# EAGLE design Touchstone (EAGLE 8.3.2)
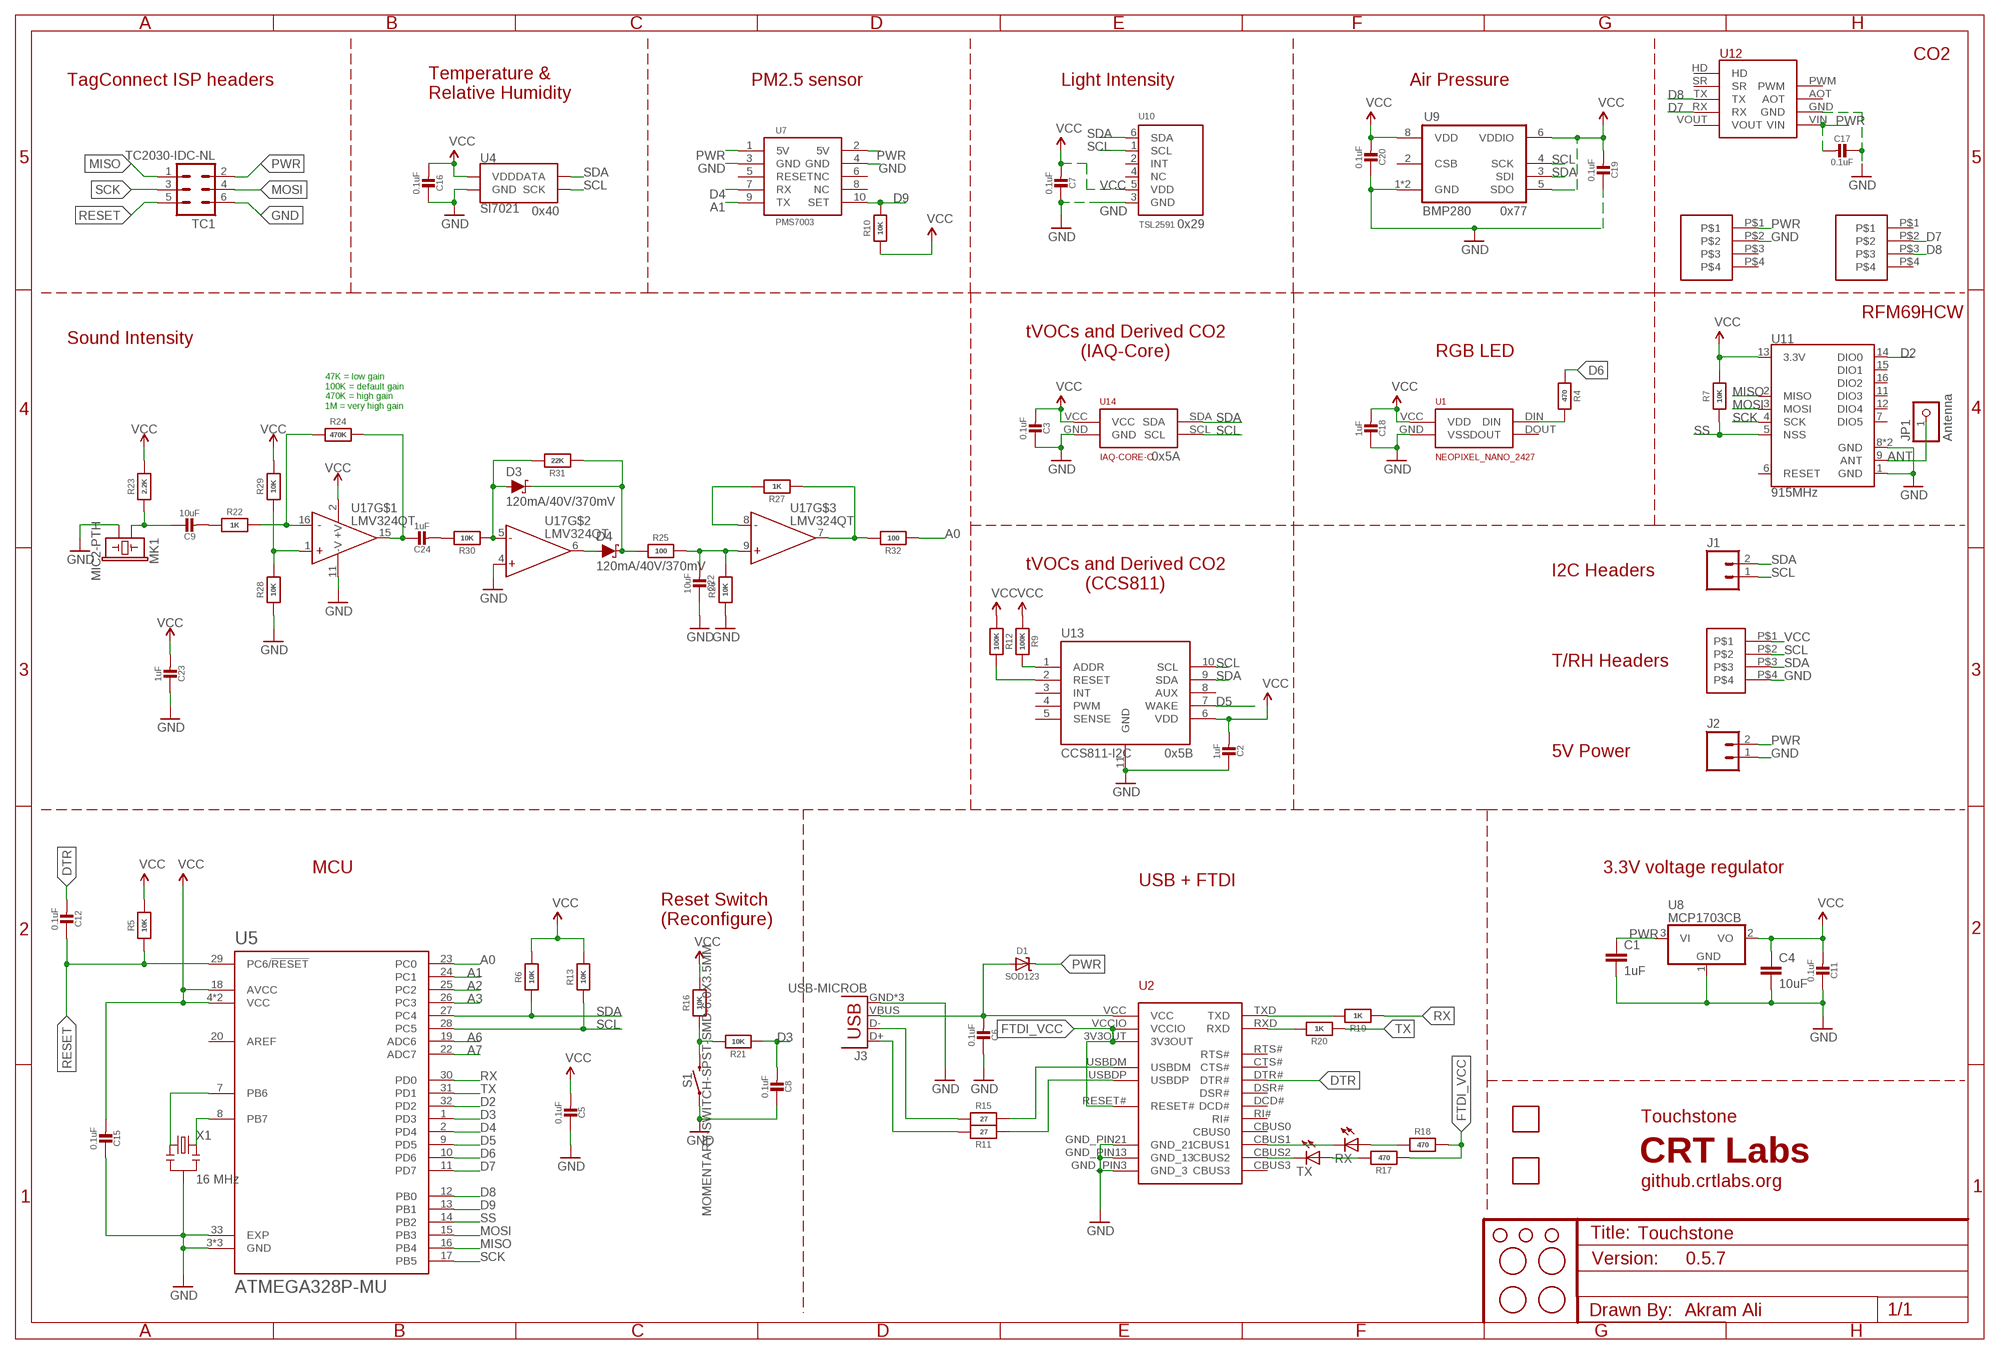
[diagram p0: schematic, sheet 1]

## Parts
C1  1uF  CAP0805  [0805]
C2  1uF  MICROBUILDER_CAP_CERAMIC_0402MP  [MICROBUILDER__0402MP]
C3  0.1uF  MICROBUILDER_CAP_CERAMIC_0402MP  [MICROBUILDER__0402MP]
C4  10uF  CAP0805  [0805]
C5  0.1uF  MICROBUILDER_CAP_CERAMIC_0402MP  [MICROBUILDER__0402MP]
C6  0.1uF  MICROBUILDER_CAP_CERAMIC_0402MP  [MICROBUILDER__0402MP]
C7  0.1uF  MICROBUILDER_CAP_CERAMIC_0402MP  [MICROBUILDER__0402MP]
C8  0.1uF  MICROBUILDER_CAP_CERAMIC_0402MP  [MICROBUILDER__0402MP]
C9  10uF  MICROBUILDER_CAP_CERAMIC_0402MP  [MICROBUILDER__0402MP]
C11  0.1uF  MICROBUILDER_CAP_CERAMIC_0402MP  [MICROBUILDER__0402MP]
C12  0.1uF  MICROBUILDER_CAP_CERAMIC_0402MP  [MICROBUILDER__0402MP]
C15  0.1uF  MICROBUILDER_CAP_CERAMIC_0402MP  [MICROBUILDER__0402MP]
C16  0.1uF  MICROBUILDER_CAP_CERAMIC_0402MP  [MICROBUILDER__0402MP]
C17  0.1uF  MICROBUILDER_CAP_CERAMIC_0402MP  [MICROBUILDER__0402MP]
C18  1uF  MICROBUILDER_CAP_CERAMIC_0402MP  [MICROBUILDER__0402MP]
C19  0.1uF  MICROBUILDER_CAP_CERAMIC_0402MP  [MICROBUILDER__0402MP]
C20  0.1uF  MICROBUILDER_CAP_CERAMIC_0402MP  [MICROBUILDER__0402MP]
C22  10uF  MICROBUILDER_CAP_CERAMIC_0402MP  [MICROBUILDER__0402MP]
C23  1uF  MICROBUILDER_CAP_CERAMIC_0402MP  [MICROBUILDER__0402MP]
C24  1uF  MICROBUILDER_CAP_CERAMIC_0402MP  [MICROBUILDER__0402MP]
D1  SOD123  MICROBUILDER_DIODE-SCHOTTKYSOD-123  [MICROBUILDER_SOD-123]
D3  120mA/40V/370mV  DIODE-SCHOTTKY-RB751S40  [SOD-523]
D4  120mA/40V/370mV  DIODE-SCHOTTKY-RB751S40  [SOD-523]
H1  STAND-OFF  [STAND-OFF]
H2  STAND-OFF  [STAND-OFF]
H3  STAND-OFF  [STAND-OFF]
J1  M02PTH  [1X02]
J2  M02PTH  [1X02]
J3  USB-MICROB  [USB-MICROB]
JP1  Antenna  PINHD-1X1CB  [1X01-CLEANBIG]
MK1  MIC2-PTH  [MICROPHONE-PTH-4.0MM]
R4  470  MICROBUILDER_RESISTOR_0402MP  [MICROBUILDER__0402MP]
R5  10K  MICROBUILDER_RESISTOR_0402MP  [MICROBUILDER__0402MP]
R6  10K  MICROBUILDER_RESISTOR_0402MP  [MICROBUILDER__0402MP]
R7  10K  MICROBUILDER_RESISTOR_0402MP  [MICROBUILDER__0402MP]
R9  100K  MICROBUILDER_RESISTOR_0402MP  [MICROBUILDER__0402MP]
R10  10K  MICROBUILDER_RESISTOR_0402MP  [MICROBUILDER__0402MP]
R11  27  MICROBUILDER_RESISTOR_0402MP  [MICROBUILDER__0402MP]
R12  100K  MICROBUILDER_RESISTOR_0402MP  [MICROBUILDER__0402MP]
R13  10K  MICROBUILDER_RESISTOR_0402MP  [MICROBUILDER__0402MP]
R15  27  MICROBUILDER_RESISTOR_0402MP  [MICROBUILDER__0402MP]
R16  10K  MICROBUILDER_RESISTOR_0402MP  [MICROBUILDER__0402MP]
R17  470  MICROBUILDER_RESISTOR_0402MP  [MICROBUILDER__0402MP]
R18  470  MICROBUILDER_RESISTOR_0402MP  [MICROBUILDER__0402MP]
R19  1K  MICROBUILDER_RESISTOR_0402MP  [MICROBUILDER__0402MP]
R20  1K  MICROBUILDER_RESISTOR_0402MP  [MICROBUILDER__0402MP]
R21  10K  MICROBUILDER_RESISTOR_0402MP  [MICROBUILDER__0402MP]
R22  1K  MICROBUILDER_RESISTOR_0402MP  [MICROBUILDER__0402MP]
R23  2.2K  MICROBUILDER_RESISTOR_0402MP  [MICROBUILDER__0402MP]
R24  470K  MICROBUILDER_RESISTOR_0402MP  [MICROBUILDER__0402MP]
R25  100  MICROBUILDER_RESISTOR_0402MP  [MICROBUILDER__0402MP]
R26  10K  MICROBUILDER_RESISTOR_0402MP  [MICROBUILDER__0402MP]
R27  1K  MICROBUILDER_RESISTOR_0402MP  [MICROBUILDER__0402MP]
R28  10K  MICROBUILDER_RESISTOR_0402MP  [MICROBUILDER__0402MP]
R29  10K  MICROBUILDER_RESISTOR_0402MP  [MICROBUILDER__0402MP]
R30  10K  MICROBUILDER_RESISTOR_0402MP  [MICROBUILDER__0402MP]
R31  22K  MICROBUILDER_RESISTOR_0402MP  [MICROBUILDER__0402MP]
R32  100  MICROBUILDER_RESISTOR_0402MP  [MICROBUILDER__0402MP]
RX  LEDCHIPLED_0805  [CHIPLED_0805]
S1  MOMENTARY-SWITCH-SPST-SMD-6.0X3.5MM  [TACTILE_SWITCH_SMD_6.0X3.5MM]
TC1  TC2030-IDC-NL  [TC2030-IDC-NL]
TX  LEDCHIPLED_0805  [CHIPLED_0805]
U1  NEOPIXEL_NANO_2427  [SK6805-2427]
U2  FT231XQ-R  [FTDI_FT231XQ-R_PACKAGE]
U4  SI7021  [DFN-6-3X3-SI7021]
U5  ATMEGA328P-MU  [QFN50P500X500X100-33N]
U7  PMS7003  [PMS7003_RECEPTACLE_1.27MM_2X5]
U8  MCP1703CB  [SOT23]
U9  BMP280  [BMP280]
U10  TSL2591  LIGHT_TSL2591  [DFN6_TAOS]
U11  915MHz  RFM69HCW-915  [RFM69HCW-XXXS2]
U12  MH-Z19  [MH-Z19]
U13  CCS811-I2C  [LGA]
U14  IAQ-CORE-C  [IAQ-CORE-C]
U15  VLP-450-F  [VLP-450-F]
U16  VLP-450-F  [VLP-450-F]
U17  LMV324QT  [QFN-16_3X3]
U$1  FIDUCIAL  [FIDUCIAL_1MM]
U$2  FIDUCIAL  [FIDUCIAL_1MM]
U$3  FIDUCIAL  [FIDUCIAL_1MM]
U$4  0878980426  [CONN_4POS_VERT_2.54_SMD]
U$5  0878980426  [CONN_4POS_VERT_2.54_SMD]
U$6  CONN_HDR_1.27MM_SMD_4POS  [CONN_HDR_1.27MM_SMD_4POS]
U$7  FIDUCIAL  [FIDUCIAL_1MM]
X1  16 MHz  RESONATORSMD  [RESONATOR-SMD]

## Nets
_OUT: R27.1 R32.2 U17.7(OUT)
A0: R32.1 U5.23(PC0)
A1: U5.24(PC1) U7.9(TX)
A2: U5.25(PC2)
A3: U5.26(PC3)
A6: U5.19(ADC6)
A7: U5.22(ADC7)
AMP: C24.1 R24.2 U17.15(OUT)
ANT: JP1.1 U11.9(ANT)
D2: U5.32(PD2) U11.14(DIO0)
D3: C8.2 R21.1 U5.1(PD3)
D4: U5.2(PD4) U7.7(RX)
D5: U5.9(PD5) U13.7(WAKE)
D6: R4.1 U5.10(PD6)
D7: U5.11(PD7) U12.RX U$5.P$2
D8: U5.12(PB0) U12.TX U$5.P$3
D9: R10.2 U5.13(PB1) U7.10(SET)
DTR: C12.2 U2.DTR#
FTDI_VCC: R17.1 R18.2 U2.3V3OUT U2.RESET# U2.VCCIO
GND: C1.2 C2.1 C3.1 C4.2 C5.1 C6.1 C7.1 C8.1 C11.1 C15.1 C16.1 C17.1 C18.1 C19.1 C20.1 C22.1 C23.1 J2.1 J3.GND J3.MT1(GND) J3.MT2(GND) MK1.GND R26.1 R28.1 S1.1 TC1.6 U1.GND(VSS) U2.GND_PIN3(GND_3) U2.GND_PIN13(GND_13) U2.GND_PIN21(GND_21) U4.GND U5.3(GND) U5.5(GND) U5.21(GND) U5.33(EXP) U7.3(GND) U7.4(GND) U8.1(GND) U9.1(GND) U9.7(GND) U10.3(GND) U11.1(GND) U11.8(GND) U11.10(GND) U12.GND U13.11(GND) U14.GND U17.4(+IN) U17.11(-V) U$4.P$2 U$6.P$4 X1.2
MISO: TC1.1 U5.16(PB4) U11.2(MISO)
MOSI: TC1.4 U5.15(PB3) U11.3(MOSI)
N$1: R4.2 U1.DIN
N$2: R20.2 U2.RXD
N$3: R19.2 U2.TXD
N$4: U5.8(PB7) X1.3
N$5: U5.7(PB6) X1.1
N$6: R12.2 U13.2(RESET)
N$7: R16.1 R21.2 S1.2
N$8: C9.2 R22.1
N$9: C9.1 MK1.OUT R23.1
N$12: R22.2 R24.1 U17.16(-IN)
N$13: R9.2 U13.1(ADDR)
N$14: D3.C D4.C R25.1 R31.1
N$15: R27.2 U17.8(-IN)
N$17: RX.C U2.CBUS1
N$18: TX.C U2.CBUS2
N$19: C24.2 R30.2
N$20: C22.2 R25.2 R26.2 U17.9(+IN)
N$21: D4.A U17.6(OUT)
N$22: D3.A R30.1 R31.2 U17.5(-IN)
N$25: R15.2 U2.USBDM
N$26: R11.1 U2.USBDP
N$27: R18.1 RX.A
N$29: R17.2 TX.A
N$32: J3.D- R15.1
N$33: J3.D+ R11.2
PWR: C1.1 C17.2 D1.C J2.2 TC1.2 U7.1(5V) U7.2(5V) U8.3(VI) U12.VIN U$4.P$1
RESET: C12.1 R5.1 TC1.5 U5.29(PC6/!RESET)
RX: R19.1 U5.30(PD0)
SCK: TC1.3 U5.17(PB5) U11.4(SCK)
SCL: J1.1 R13.1 U4.SCK U5.28(PC5) U9.4(SCK) U10.1(SCL) U13.10(SCL) U14.SCL U$6.P$2
SDA: J1.2 R6.1 U4.DATA U5.27(PC4) U9.3(SDI) U10.6(SDA) U13.9(SDA) U14.SDA U$6.P$3
SS: R7.1 U5.14(PB2) U11.5(NSS)
TX: R20.1 U5.31(PD1)
VBUS: C6.2 D1.A J3.VBUS U2.VCC
VCC: C2.2 C3.2 C4.1 C5.2 C7.2 C11.2 C15.2 C16.2 C18.2 C19.2 C20.2 C23.2 R5.2 R6.2 R7.2 R9.1 R10.1 R12.1 R13.2 R16.2 R23.2 R29.2 U1.VCC(VDD) U4.VDD U5.4(VCC) U5.6(VCC) U5.18(AVCC) U8.2(VO) U9.5(SDO) U9.6(VDDIO) U9.8(VDD) U10.5(VDD) U11.13(3.3V) U13.6(VDD) U14.VCC U17.2(+V) U$6.P$1
VCC/2: R28.2 R29.1 U17.1(+IN)
Unconnected: U1.DOUT U2.CBUS0 U2.CBUS3 U2.CTS# U2.DCD# U2.DSR# U2.RI# U2.RTS# U5.20(AREF) U7.5(RESET) U7.6(NC) U7.8(NC) U9.2(CSB) U10.2(INT) U10.4(NC) U11.6(RESET) U11.7(DIO5) U11.11(DIO3) U11.12(DIO4) U11.15(DIO1) U11.16(DIO2) U12.AOT U12.HD U12.PWM U12.SR U12.VOUT U13.3(INT) U13.4(PWM) U13.5(SENSE) U13.8(AUX) U17.12(+IN) U17.13(-IN) U17.14(OUT) U$4.P$3 U$4.P$4 U$5.P$1 U$5.P$4

## Notes on the sheet
- CO2
- TagConnect ISP headers | PM2.5 sensor | Light Intensity | Air Pressure
- Temperature &
  Relative Humidity
- 0x40 | 0x77
- 0x29
- RFM69HCW
- Sound Intensity
- tVOCs and Derived CO2
  (IAQ-Core)
- RGB LED
- 47K = low gain
  100K = default gain
  470K = high gain
  1M = very high gain
- 0x5A
- I2C Headers
- tVOCs and Derived CO2
  (CCS811)
- T/RH Headers
- 0x5B | 5V Power
- MCU | 3.3V voltage regulator
- USB + FTDI
- Reset Switch
  (Reconfigure)
- Touchstone
- CRT Labs
- github.crtlabs.org
- 0.5.7
- Akram Ali

## Library data of the parts
C1 = SparkFun-Capacitors:CAP: Capacitor Standard 0603 ceramic capacitor, and 0.1" leaded capacitor.; MPN: CC0805ZRY5V8BB105
C2 C18 C23 C24 = Adafruit Feather 32u4 Bluefruit LE:MICROBUILDER_CAP_CERAMIC: Ceramic Capacitors For new designs, use the packages preceded by an '_' character since they are more reliable: The following footprints should be used on most boards: _0402 - Standard footprint for regular board layouts _0603 - Standard footprint for regular board layouts _0805 - Standard footprint for regular board layouts _1206 - Standard footprint for regular board layouts For extremely tight-pitch boards where space is at a premium, the following 'micro-pitch' footprints can be used (smaller pads, no silkscreen outline, etc.): _0402MP - Micro-pitch footprint for very dense/compact boards _0603MP - Micro-pitch footprint for very dense/compact boards _0805MP - Micro-pitch footprint for very dense/compact boards _1206MP - Micro-pitch footprint for very dense/compact boards; MPN: CC0402KRX5R6BB105
C3 C5-C8 C11 C12 C15-C17 C19 C20 = Adafruit Feather 32u4 Bluefruit LE:MICROBUILDER_CAP_CERAMIC: Ceramic Capacitors For new designs, use the packages preceded by an '_' character since they are more reliable: The following footprints should be used on most boards: _0402 - Standard footprint for regular board layouts _0603 - Standard footprint for regular board layouts _0805 - Standard footprint for regular board layouts _1206 - Standard footprint for regular board layouts For extremely tight-pitch boards where space is at a premium, the following 'micro-pitch' footprints can be used (smaller pads, no silkscreen outline, etc.): _0402MP - Micro-pitch footprint for very dense/compact boards _0603MP - Micro-pitch footprint for very dense/compact boards _0805MP - Micro-pitch footprint for very dense/compact boards _1206MP - Micro-pitch footprint for very dense/compact boards; MPN: GRM155R71C104KA88J
C4 = SparkFun-Capacitors:CAP: Capacitor Standard 0603 ceramic capacitor, and 0.1" leaded capacitor.; MPN: CC0805KKX5R6BB106
C9 C22 = Adafruit Feather 32u4 Bluefruit LE:MICROBUILDER_CAP_CERAMIC: Ceramic Capacitors For new designs, use the packages preceded by an '_' character since they are more reliable: The following footprints should be used on most boards: _0402 - Standard footprint for regular board layouts _0603 - Standard footprint for regular board layouts _0805 - Standard footprint for regular board layouts _1206 - Standard footprint for regular board layouts For extremely tight-pitch boards where space is at a premium, the following 'micro-pitch' footprints can be used (smaller pads, no silkscreen outline, etc.): _0402MP - Micro-pitch footprint for very dense/compact boards _0603MP - Micro-pitch footprint for very dense/compact boards _0805MP - Micro-pitch footprint for very dense/compact boards _1206MP - Micro-pitch footprint for very dense/compact boards; MPN: GRJ155R60J106ME11D
D1 = Adafruit Feather 32u4 Bluefruit LE:MICROBUILDER_DIODE-SCHOTTKY; MPN: SD103AW-13-F
D3 D4 = SparkFun-DiscreteSemi:DIODE-SCHOTTKY: Schottky diode A Schottky diode is a semiconductor diode which has a low forward voltage drop and a very fast switching action.; MPN: RB751S40T1G; PROD_ID: DIO-11018
H1-H3 = SparkFun-Electromechanical:STAND-OFF: #4 Stand Off This is the mechanical footprint for a #4 phillips button head screw. Use the keepout ring to avoid running the screw head into surrounding components. SKU : PRT-00447
J1 J2 = SparkFun-Connectors:M02: Standard 2-pin 0.1" header. Use with - straight break away headers ( PRT-00116) - right angle break away headers (PRT-00553) - swiss pins (PRT-00743) - machine pins (PRT-00117) - female headers (PRT-00115) Molex polarized connector foot print use with: PRT-08233 with associated crimp pins and housings. 2.54_SCREWTERM for use with PRT-10571. 3.5mm Screw Terminal footprints for PRT-08084 5mm Screw Terminal footprints for use with PRT-08432
J3 = SparkFun-Connectors:USB: USB Connectors USB-B-PTH is fully proven SKU : PRT-00139/CONN-08278 USB-miniB is fully proven SKU : PRT-00587 USB-A-PCB is untested. USB-A-H is throughly reviewed, but untested. Spark Fun Electronics SKU : PRT-00437 USB-B-SMT is throughly reviewed, but untested. Needs silkscreen touching up. USB-A-S has not been used/tested USB-MB-H has not been used/tested USB-MICROB has been used. CONN-09505; MPN: ZX62-B-5PA(33); PROD_ID: CONN-09505
JP1 = adafruit@1:PINHD-1X1: Pin header 1x1 for 0.1" spacing With round pins; MPN: Helical antenna
MK1 = CMC-4015-40P:MIC2: Mini Electret Microphone Omni-directional electret microphone. MPN: CMC-4015-40P; MPN: TOM-1545P-R; PROD_ID: COMP-08856; SF_ID: COM-08635
R4 R17 R18 = Adafruit Feather 32u4 Bluefruit LE:MICROBUILDER_RESISTOR: Resistors For new designs, use the packages preceded by an '_' character since they are more reliable: The following footprints should be used on most boards: _0402 - Standard footprint for regular board layouts _0603 - Standard footprint for regular board layouts _0805 - Standard footprint for regular board layouts _1206 - Standard footprint for regular board layouts For extremely tight-pitch boards where space is at a premium, the following 'micro-pitch' footprints can be used (smaller pads, no silkscreen outline, etc.): _0402MP - Micro-pitch footprint for very dense/compact boards _0603MP - Micro-pitch footprint for very dense/compact boards _0805MP - Micro-pitch footprint for very dense/compact boards _1206MP - Micro-pitch footprint for very dense/compact boards; MPN: RC0402JR-07470RL
R5-R7 R10 R13 R16 R21 = Adafruit Feather 32u4 Bluefruit LE:MICROBUILDER_RESISTOR: Resistors For new designs, use the packages preceded by an '_' character since they are more reliable: The following footprints should be used on most boards: _0402 - Standard footprint for regular board layouts _0603 - Standard footprint for regular board layouts _0805 - Standard footprint for regular board layouts _1206 - Standard footprint for regular board layouts For extremely tight-pitch boards where space is at a premium, the following 'micro-pitch' footprints can be used (smaller pads, no silkscreen outline, etc.): _0402MP - Micro-pitch footprint for very dense/compact boards _0603MP - Micro-pitch footprint for very dense/compact boards _0805MP - Micro-pitch footprint for very dense/compact boards _1206MP - Micro-pitch footprint for very dense/compact boards; MPN: RC0402JR-0710KL
R9 R12 = Adafruit Feather 32u4 Bluefruit LE:MICROBUILDER_RESISTOR: Resistors For new designs, use the packages preceded by an '_' character since they are more reliable: The following footprints should be used on most boards: _0402 - Standard footprint for regular board layouts _0603 - Standard footprint for regular board layouts _0805 - Standard footprint for regular board layouts _1206 - Standard footprint for regular board layouts For extremely tight-pitch boards where space is at a premium, the following 'micro-pitch' footprints can be used (smaller pads, no silkscreen outline, etc.): _0402MP - Micro-pitch footprint for very dense/compact boards _0603MP - Micro-pitch footprint for very dense/compact boards _0805MP - Micro-pitch footprint for very dense/compact boards _1206MP - Micro-pitch footprint for very dense/compact boards; MPN: RC0402FR-07100KL
R11 R15 = Adafruit Feather 32u4 Bluefruit LE:MICROBUILDER_RESISTOR: Resistors For new designs, use the packages preceded by an '_' character since they are more reliable: The following footprints should be used on most boards: _0402 - Standard footprint for regular board layouts _0603 - Standard footprint for regular board layouts _0805 - Standard footprint for regular board layouts _1206 - Standard footprint for regular board layouts For extremely tight-pitch boards where space is at a premium, the following 'micro-pitch' footprints can be used (smaller pads, no silkscreen outline, etc.): _0402MP - Micro-pitch footprint for very dense/compact boards _0603MP - Micro-pitch footprint for very dense/compact boards _0805MP - Micro-pitch footprint for very dense/compact boards _1206MP - Micro-pitch footprint for very dense/compact boards; MPN: RC0402JR-0727RL
R19 R20 = Adafruit Feather 32u4 Bluefruit LE:MICROBUILDER_RESISTOR: Resistors For new designs, use the packages preceded by an '_' character since they are more reliable: The following footprints should be used on most boards: _0402 - Standard footprint for regular board layouts _0603 - Standard footprint for regular board layouts _0805 - Standard footprint for regular board layouts _1206 - Standard footprint for regular board layouts For extremely tight-pitch boards where space is at a premium, the following 'micro-pitch' footprints can be used (smaller pads, no silkscreen outline, etc.): _0402MP - Micro-pitch footprint for very dense/compact boards _0603MP - Micro-pitch footprint for very dense/compact boards _0805MP - Micro-pitch footprint for very dense/compact boards _1206MP - Micro-pitch footprint for very dense/compact boards; MPN: RC0402JR-071KL
R22 R27 = Adafruit PowerBoost 1000C Rev B:MICROBUILDER_RESISTOR: Resistors For new designs, use the packages preceded by an '_' character since they are more reliable: The following footprints should be used on most boards: _0402 - Standard footprint for regular board layouts _0603 - Standard footprint for regular board layouts _0805 - Standard footprint for regular board layouts _1206 - Standard footprint for regular board layouts For extremely tight-pitch boards where space is at a premium, the following 'micro-pitch' footprints can be used (smaller pads, no silkscreen outline, etc.): _0402MP - Micro-pitch footprint for very dense/compact boards _0603MP - Micro-pitch footprint for very dense/compact boards _0805MP - Micro-pitch footprint for very dense/compact boards _1206MP - Micro-pitch footprint for very dense/compact boards; MPN: RC0402JR-071KL
R23 = Adafruit PowerBoost 1000C Rev B:MICROBUILDER_RESISTOR: Resistors For new designs, use the packages preceded by an '_' character since they are more reliable: The following footprints should be used on most boards: _0402 - Standard footprint for regular board layouts _0603 - Standard footprint for regular board layouts _0805 - Standard footprint for regular board layouts _1206 - Standard footprint for regular board layouts For extremely tight-pitch boards where space is at a premium, the following 'micro-pitch' footprints can be used (smaller pads, no silkscreen outline, etc.): _0402MP - Micro-pitch footprint for very dense/compact boards _0603MP - Micro-pitch footprint for very dense/compact boards _0805MP - Micro-pitch footprint for very dense/compact boards _1206MP - Micro-pitch footprint for very dense/compact boards; MPN: RC0402FR-072K2L
R24 = Adafruit PowerBoost 1000C Rev B:MICROBUILDER_RESISTOR: Resistors For new designs, use the packages preceded by an '_' character since they are more reliable: The following footprints should be used on most boards: _0402 - Standard footprint for regular board layouts _0603 - Standard footprint for regular board layouts _0805 - Standard footprint for regular board layouts _1206 - Standard footprint for regular board layouts For extremely tight-pitch boards where space is at a premium, the following 'micro-pitch' footprints can be used (smaller pads, no silkscreen outline, etc.): _0402MP - Micro-pitch footprint for very dense/compact boards _0603MP - Micro-pitch footprint for very dense/compact boards _0805MP - Micro-pitch footprint for very dense/compact boards _1206MP - Micro-pitch footprint for very dense/compact boards; MPN: RC0402FR-071ML
R25 R32 = Adafruit PowerBoost 1000C Rev B:MICROBUILDER_RESISTOR: Resistors For new designs, use the packages preceded by an '_' character since they are more reliable: The following footprints should be used on most boards: _0402 - Standard footprint for regular board layouts _0603 - Standard footprint for regular board layouts _0805 - Standard footprint for regular board layouts _1206 - Standard footprint for regular board layouts For extremely tight-pitch boards where space is at a premium, the following 'micro-pitch' footprints can be used (smaller pads, no silkscreen outline, etc.): _0402MP - Micro-pitch footprint for very dense/compact boards _0603MP - Micro-pitch footprint for very dense/compact boards _0805MP - Micro-pitch footprint for very dense/compact boards _1206MP - Micro-pitch footprint for very dense/compact boards; MPN: RC0402FR-07100RL
R26 R28-R30 = Adafruit PowerBoost 1000C Rev B:MICROBUILDER_RESISTOR: Resistors For new designs, use the packages preceded by an '_' character since they are more reliable: The following footprints should be used on most boards: _0402 - Standard footprint for regular board layouts _0603 - Standard footprint for regular board layouts _0805 - Standard footprint for regular board layouts _1206 - Standard footprint for regular board layouts For extremely tight-pitch boards where space is at a premium, the following 'micro-pitch' footprints can be used (smaller pads, no silkscreen outline, etc.): _0402MP - Micro-pitch footprint for very dense/compact boards _0603MP - Micro-pitch footprint for very dense/compact boards _0805MP - Micro-pitch footprint for very dense/compact boards _1206MP - Micro-pitch footprint for very dense/compact boards; MPN: RC0402JR-0710KL
R31 = Adafruit PowerBoost 1000C Rev B:MICROBUILDER_RESISTOR: Resistors For new designs, use the packages preceded by an '_' character since they are more reliable: The following footprints should be used on most boards: _0402 - Standard footprint for regular board layouts _0603 - Standard footprint for regular board layouts _0805 - Standard footprint for regular board layouts _1206 - Standard footprint for regular board layouts For extremely tight-pitch boards where space is at a premium, the following 'micro-pitch' footprints can be used (smaller pads, no silkscreen outline, etc.): _0402MP - Micro-pitch footprint for very dense/compact boards _0603MP - Micro-pitch footprint for very dense/compact boards _0805MP - Micro-pitch footprint for very dense/compact boards _1206MP - Micro-pitch footprint for very dense/compact boards; MPN: RC0402JR-0722KL
RX TX = adafruit:LED: LED OSRAM: - CHIPLED LG R971, LG N971, LY N971, LG Q971, LY Q971, LO R971, LY R971 LH N974, LH R974 LS Q976, LO Q976, LY Q976 LO Q996 - Hyper CHIPLED LW Q18S LB Q993, LB Q99A, LB R99A - SideLED LS A670, LO A670, LY A670, LG A670, LP A670 LB A673, LV A673, LT A673, LW A673 LH A674 LY A675 LS A676, LA A676, LO A676, LY A676, LW A676 LS A679, LY A679, LG A679 - Hyper Micro SIDELED® LS Y876, LA Y876, LO Y876, LY Y876 LT Y87S - SmartLED LW L88C, LW L88S LB L89C, LB L89S, LG L890 LS L89K, LO L89K, LY L89K LS L896, LA L896, LO L896, LY L896 - TOPLED LS T670, LO T670, LY T670, LG T670, LP T670 LSG T670, LSP T670, LSY T670, LOP T670, LYG T670 LG T671, LOG T671, LSG T671 LB T673, LV T673, LT T673, LW T673 LH T674 LS T676, LA T676, LO T676, LY T676, LB T676, LH T676, LSB T676, LW T676 LB T67C, LV T67C, LT T67C, LS T67K, LO T67K, LY T67K, LW E67C LS E67B, LA E67B, LO E67B, LY E67B, LB E67C, LV E67C, LT E67C LW T67C LS T679, LY T679, LG T679 LS T770, LO T770, LY T770, LG T770, LP T770 LB T773, LV T773, LT T773, LW T773 LH T774 LS E675, LA E675, LY E675, LS T675 LS T776, LA T776, LO T776, LY T776, LB T776 LHGB T686 LT T68C, LB T68C - Hyper Mini TOPLED® LB M676 - Mini TOPLED Santana® LG M470 LS M47K, LO M47K, LY M47K Source: http://www.osram.convergy.de/; MPN: LG R971-KN-1; OC_NEWARK: unknown
S1 = SparkFun-Switches:MOMENTARY-SWITCH-SPST: Momentary Switch (Pushbutton) - SPST Normally-open (NO) SPST momentary switches (buttons, pushbuttons). Variants PTH-12MM - 12mm square, through-hole Momentary Pushbutton Switch - 12mm Square <https://www.sparkfun.com/products/9190> (COM-09190) PTH-6.0MM, PTH-6.0MM-KIT - 6.0mm square, through-hole Mini Pushbutton Switch <https://www.sparkfun.com/products/97> (COM-00097) KIT package intended for soldering kit's - only one side of pads' copper is exposed. PTH-RIGHT-ANGLE-KIT - Right-angle, through-hole Right Angle Tactile Button <https://www.sparkfun.com/products/10791> - Used on SparkFun BigTime Watch Kit <https://www.sparkfun.com/products/11734> SMD-12MM - 12mm square, surface-mount Tactile Button - SMD (12mm) <https://www.sparkfun.com/products/12993> (COM-12993) Used on SparkFun PicoBoard <https://www.sparkfun.com/products/11888> SMD-4.5MM - 4.5mm Square Trackball Switch Used on SparkFun Blackberry Trackballer Breakout <https://www.sparkfun.com/products/13169> SMD-4.6MMX2.8MM - 4.60mm x 2.80mm, surface mount Used on SparkFun SAMD21 Mini Breakout <https://www.sparkfun.com/products/13664> SMD-5.2MM, SMD-5.2-REDUNDANT - 5.2mm square, surface-mount Mini Pushbutton Switch - SMD <https://www.sparkfun.com/products/8720> (COM-08720) Used on Arduino Pro Mini <https://www.sparkfun.com/products/11114> REDUNDANT package connects both switch circuits together SMD-6.0X3.5MM - 6.0 x 3.5mm, surface mount Momentary Reset Switch SMD <https://www.sparkfun.com/products/8229> (COM-08229) SMD-6.2MM-TALL - 6.2mm square, surface mount Tactile Button - SMD (6mm) <https://www.sparkfun.com/products/12992> Used on SparkFun Digital Sandbox <https://www.sparkfun.com/products/12651> SMD-RIGHT-ANGLE - Right-angle, surface mount Used on SparkFun Block for Intel® Edison - Arduino <https://www.sparkfun.com/products/13036>; MPN: RS-032G05A3-SM RT; PROD_ID: SWCH-00815; SF_SKU: COM-08229
TC1 = TagConnect:TC2030-IDC: Tag-Connect In Circuit Programming & Debug Cable 6 Pin http://www.tag-connect.com
U1 = NeoPixel Nano 2427:NEOPIXEL_NANO_2427; MPN: 3484
U2 = ftdi_ft231xq-r:FT231XQ-R: This is the 20-LD QFN package of the FTDI FT231XQ-R chip.; MPN: FT231XQ-R
U4 = SparkFun-Sensors:SI7021: Silicon Labs Si7021 I2C Humidity and Temperature Sensor The Si7021 is a low-cost, easy-to-use, highly accurate, digital humidity and temperature sensor. This sensor is ideal for environmental sensing and data logging and perfect for build a weather stations or humidor control system. All you need are two lines for I2C communication, and you’ll have relative humidity readings and very accurate temperature readings as a bonus! Datasheet <https://cdn.sparkfun.com/datasheets/Sensors/Weather/Si7021.pdf> SparkFun Products SparkFun Humidity and Temperature Sensor Breakout - Si7021 <https://www.sparkfun.com/products/13763> (SEN-13763) SparkFun Blynk Board - ESP8266 <https://www.sparkfun.com/products/13794> (WRL-13794); MPN: SI7021-A20-GM1; PROD_ID: IC-13093
U5 = ATMEGA328P-MU:ATMEGA328P-MU: ATmega Series 20 MHz 32 KB Flash 2 KB SRAM 8-Bit Microcontroller - QFN-32; AVAILABILITY: Good; DESCRIPTION: ATmega Series 20 MHz 32 KB Flash 2 KB SRAM 8-Bit Microcontroller - QFN-32; MF: Atmel; MP: ATMEGA328P-MU; MPN: ATMEGA328P-MU; PACKAGE: QFN-32 Atmel; PRICE: 2.55 USD
U7 = Amphenol:PMS7003: 2x5 header 1.27mm pitch This is a library for Amphenol FCI 2x5 header with 1.27mm pitch used on Plant Tower's PMS7003 PM2.5 laser sensor. MPN: 20021311-00010T4LF Datasheet: http://www.mouser.com/ds/2/18/20021311-974469.pdf Designed by Akram Ali https://github.com/AKstudios; MPN: 20021311-00012T4LF
U8 = linear:MCP1703: 250 mA, 16V, Low Quiescent Current LDO Regulator Source: http://ww1.microchip.com/downloads/en/DeviceDoc/22049b.pdf; MPN: MCP1703T-3302E/CB; OC_NEWARK: 18T9177
U9 = bosch-bmp280:BMP280: The BMP280 is an absolute barometric pressure sensor especially designed for mobile applications. The sensor module is housed in an extremely compact 8-pin metal-lid LGA package with a footprint of only 2.0 × 2.5 mm2 and 0.95 mm package height. Its small dimensions and its low power consumption of 2.7 μA @1Hz allow the implementation in battery driven devices such as mobile phones, GPS modules or watches. The library has been designed by Richard Magdycz <https://www.facebook.com/groups/eaglecadsoftUK>; MPN: BMP280
U10 = TSL2591:LIGHT_TSL2591: TSL2591 Light-To-Digital Sensor; MPN: TSL25911FN
U11 = SparkFun-RF:RFM69H: Hope RF RFM69H ISM Transceiver Module The RFM69H is a transceiver module capable of operation over a wide frequency range, including the 315,433,868 and 915MHz license-free ISM (Industry Scientific and Medical) frequency bands. All major RF communication parameters are programmable and most of them can be dynamically set. The RFM69H offers the unique advantage of programmable narrow-band and wide- band communication modes. The RFM69H is optimized for low power consumption while offering high RF output power and channelized operation.Compliance ETSI and FCC regulations. Datasheet <http://www.hoperf.cn/upload/docs/RF/SX/RFM69H_DataSheet_v1.3.pdf> SparkFun Products RFM69HCW Wireless Transceiver - 915MHz <https://www.sparkfun.com/products/13909> (COM-13909) RFM69HCW Wireless Transceiver - 434MHz <https://www.sparkfun.com/products/13910> (COM-13910) SparkFun RFM69 Breakout (915MHz) <https://www.sparkfun.com/products/12775> (WRL-12775) SparkFun RFM69 Breakout (434MHz) <https://www.sparkfun.com/products/12823> (WRL-12823); MPN: RFM69HCW; PROD_ID: IC-11997
U12 = MH-z19:MH-Z19: MH-z19 Footprint EAGLE footprint of MH-z19 CO2 sensor. Designed by AKstudios github.com/akstudios; MPN: MH-z19
U13 = CCS811:CCS811; MPN: CCS811
U14 = IAQ-Core:IAQ-CORE-C: AMS IAQ-Core This is the EAGLE footprint of the IAQ-Core by AMS. http://ams.com/eng/Products/Environmental-Sensors/Air-Quality-Sensors/iAQ-core-C Designed by AKstudios github.com/akstudios; MPN: IAQ-CORE-C
U15 = VLP-450-F:VLP-450-F; MPN: VLP-650-F
U16 = VLP-450-F:VLP-450-F; MPN: VLP-550-F
U17 = LMV324:LMV324QT; MPN: LM324QT
U$1-U$3 U$7 = adafruit:FIDUCIAL: For use by pick and place machines to calibrate the vision/machine, 1mm By microbuilder.eu
U$4 U$5 = 0878980426:0878980426: CONN HEADER 4POS VERT 2.54MM SMD MPN: 0878980426 Designed by AKstudios github.com/AKstudios; MPN: 0878980426
U$6 = CONN_HDR_1.27MM_SMD_4POS:CONN_HDR_1.27MM_SMD_4POS: MPN: M50-3630442; MPN: M50-3630442
X1 = SparkFun:RESONATOR: Resonator Small SMD resonator. This is the itty bitty 10/20MHz resonators with built in caps. CSTCE10M0G55 and CSTCE20M0V53. Footprint has been reviewed closely but hasn't been tested yet.; MPN: CSTCE16M0V53-R0

## Net classes
1 power: width 0.381 mm, clearance 0.254 mm

## Board
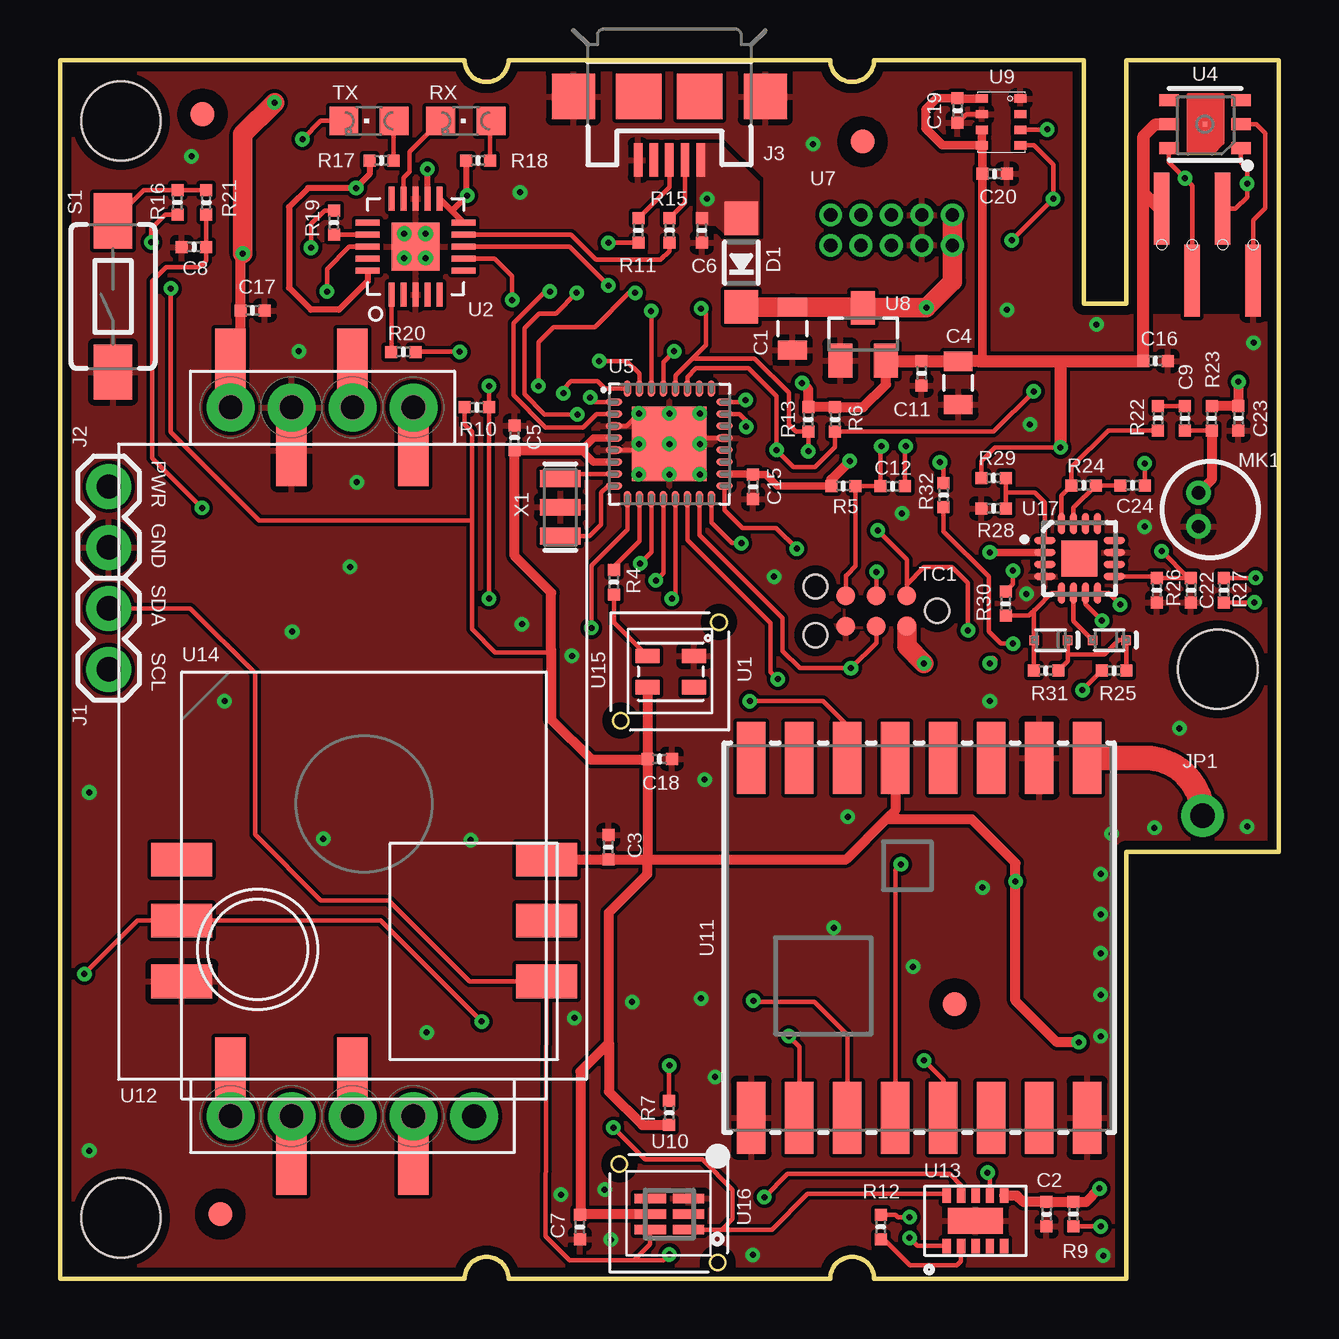
[diagram p1: board, top side]
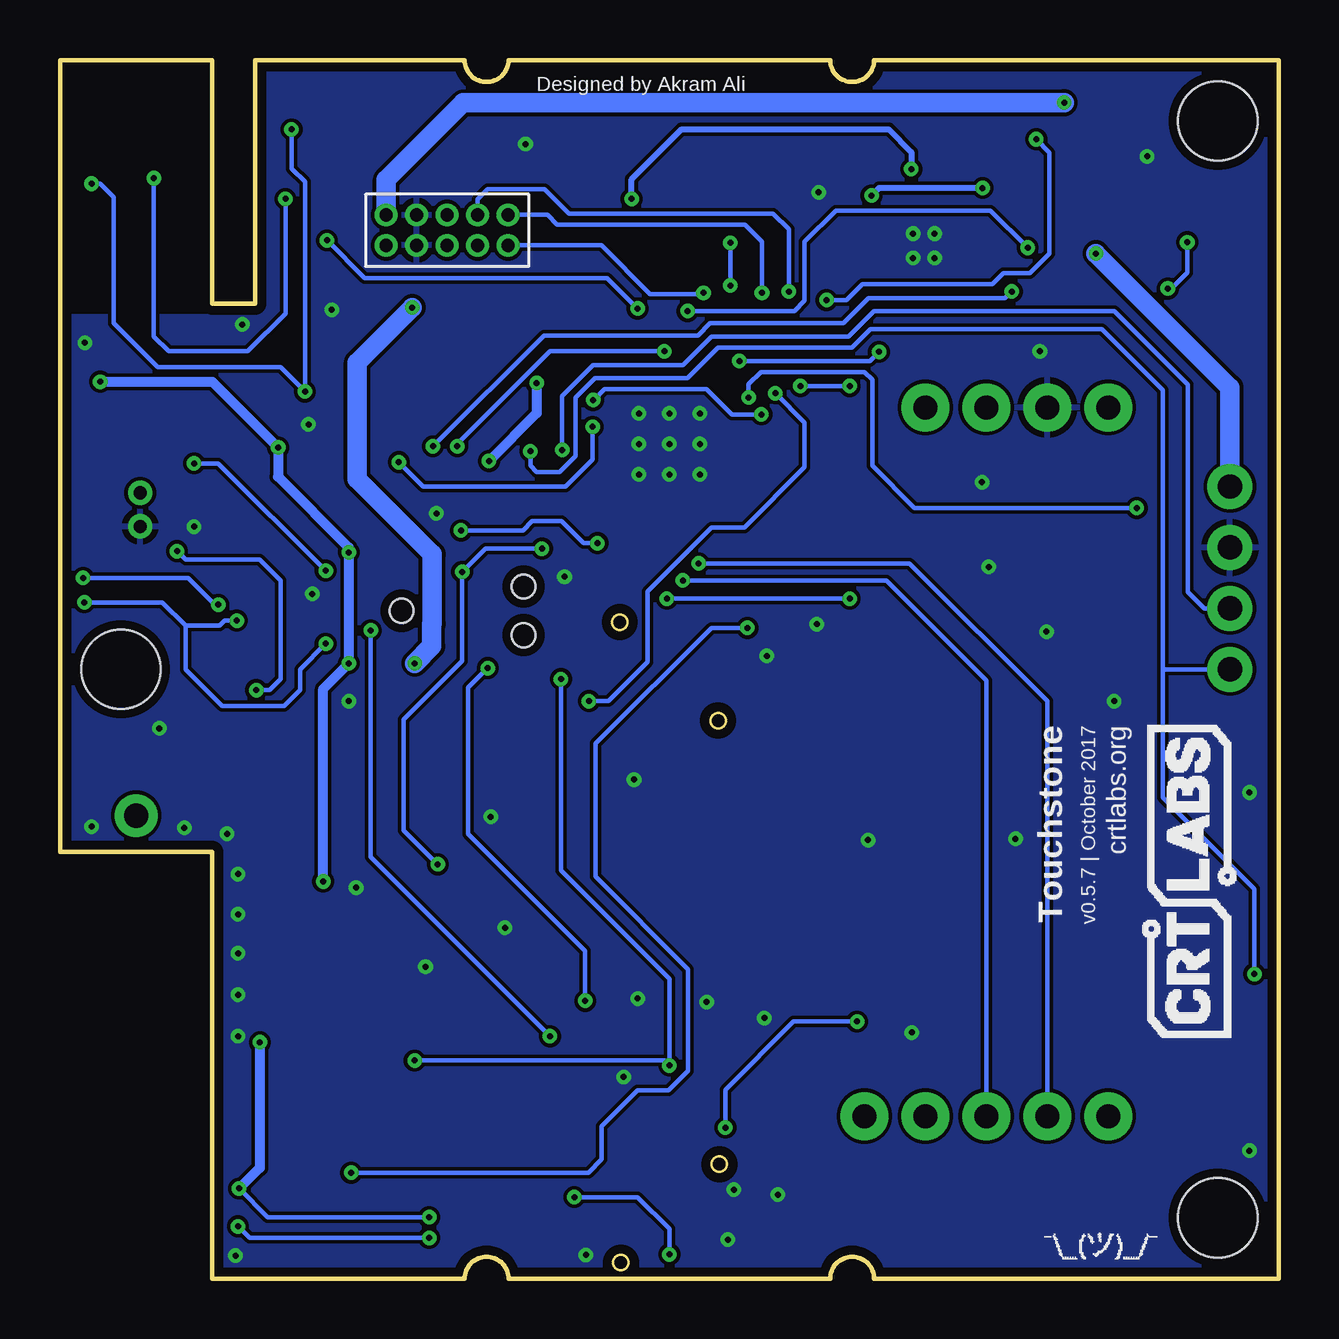
[diagram p2: board, bottom side, seen from below]

Size 50.8 x 50.8 mm. Coordinates in mm from the lower left corner, seen from the top.
Outline: 0,0 16.87,0 arc-90 17.78,0.91 arc-90 18.69,0 32.11,0 arc-90 33.02,0.91 arc-90 33.93,0 44.45,0 44.45,17.78 50.8,17.78 50.8,50.8 44.45,50.8 44.45,40.64 42.67,40.64 42.67,50.8 33.93,50.8 arc-90 33.02,49.89 arc-90 32.11,50.8 18.69,50.8 arc-90 17.78,49.89 arc-90 16.87,50.8 0,50.8 0,0
Copper layers (1*16): Top 0.0356mm / dielectric 1.5011mm / Bottom 0.0356mm
Design rules "oshpark-2layer": minimum track width 6mil, minimum drill 13mil, track to track 6mil, track to pad 6mil, pad to pad 6mil, via to via 6mil, smd to smd 6mil, copper to edge 15mil, drill to drill 6mil, minimum pad ring 7mil, minimum via ring 7mil, stop-mask expansion 2.5mil, vias tented up to drill 0mil, thermal gap 10mil

### Footprints (pad centres in the part's own frame; a part is rotated, then mirrored left to right if it is on the bottom)
0805 = smd 0.8 x 1.2: 1 -0.9,0; 2 0.9,0
MICROBUILDER__0402MP = smd 0.5 x 0.5: 1 -0.508,0; 2 0.508,0
MICROBUILDER_SOD-123 = smd 1.4 x 1.4: A 1.85,0; C -1.85,0
SOD-523 = smd 0.4 x 0.4: A -0.7,0; C 0.7,0
STAND-OFF = hole 3.302: 0,0
1X02 = drill 1.016 pad 1.88: 1 0,0; 2 2.54,0
USB-MICROB = smd 0.35 x 1.4: D+ 0,2.65; D- -0.65,2.65; GND 1.3,2.65; ID 0.65,2.65; VBUS -1.3,2.65 | smd 1.8 x 1.9: MT1 -4,0; MT2 4,0 | smd 1.9 x 1.9: P$1 -1.27,0; P$2 1.27,0
1X01-CLEANBIG = drill 1.016 pad 1.778: 1 0,0
MICROPHONE-PTH-4.0MM = drill 0.55 pad 1.016: GND -0.7,0.5; OUT 0.7,0.5
CHIPLED_0805 = smd 1.2 x 1.2: A 0,-1.05; C 0,1.05
TACTILE_SWITCH_SMD_6.0X3.5MM = smd 2.3 x 1.6: 1 -3.15,0; 2 3.15,0
TC2030-IDC-NL = smd 0.787 x 0.787: 1 -1.27,-0.635; 2 -1.27,0.635; 3 0,-0.635; 4 0,0.635; 5 1.27,-0.635; 6 1.27,0.635 | hole 0.991: -2.54,0; 2.54,1.016; 2.54,-1.016
SK6805-2427 = smd 1 x 0.6: DIN 0.375,1.85; DOUT 2.325,0.55; GND 2.325,1.85; VCC 0.375,0.55
FTDI_FT231XQ-R_PACKAGE = smd 0.25 x 1: 3V3OUT 0.968,-2.032; CBUS2 -0.532,-2.032; CBUS3 0.968,1.968; CTS# -1.032,-2.032; DTR# -0.032,1.968; RTS# -0.532,1.968; TXD 0.468,1.968; USBDM 0.468,-2.032; USBDP -0.032,-2.032; VCCIO -1.032,1.968 | smd 1 x 0.25: CBUS0 1.968,0.968; CBUS1 1.968,0.468; DCD# -2.032,-1.032; DSR# -2.032,-0.532; GND_PIN3 -2.032,-0.032; GND_PIN13 1.968,-0.032; RESET# 1.968,-1.032; RI# -2.032,0.468; RXD -2.032,0.968; VCC 1.968,-0.532 | smd 2 x 2: GND_PIN21 -0.032,-0.032
DFN-6-3X3-SI7021 = smd 0.2 x 0.2: 7 0,0 | smd 0.8 x 0.5: DATA 1.5,-1; GND 1.5,0; NC@3 1.5,1; NC@4 -1.5,1; SCK -1.5,-1; VDD -1.5,0
QFN50P500X500X100-33N = smd 0.7 x 0.3: 1 -2.3,1.75; 2 -2.3,1.25; 3 -2.3,0.75; 4 -2.3,0.25; 5 -2.3,-0.25; 6 -2.3,-0.75; 7 -2.3,-1.25; 8 -2.3,-1.75; 17 2.3,-1.75; 18 2.3,-1.25; 19 2.3,-0.75; 20 2.3,-0.25; 21 2.3,0.25; 22 2.3,0.75; 23 2.3,1.25; 24 2.3,1.75 | smd 0.3 x 0.7: 9 -1.75,-2.3; 10 -1.25,-2.3; 11 -0.75,-2.3; 12 -0.25,-2.3; 13 0.25,-2.3; 14 0.75,-2.3; 15 1.25,-2.3; 16 1.75,-2.3; 25 1.75,2.3; 26 1.25,2.3; 27 0.75,2.3; 28 0.25,2.3; 29 -0.25,2.3; 30 -0.75,2.3; 31 -1.25,2.3; 32 -1.75,2.3 | smd 3.1 x 3.1: 33 0,0
PMS7003_RECEPTACLE_1.27MM_2X5 = drill 0.55 pad 0.95: 1 4.865,4.865; 2 6.135,4.865; 3 4.865,6.135; 4 6.135,6.135; 5 4.865,7.405; 6 6.135,7.405; 7 4.865,8.675; 8 6.135,8.675; 9 4.865,9.945; 10 6.135,9.945
SOT23 = smd 1 x 1.4: 1 -0.95,-1.1; 2 0.95,-1.1; 3 0,1.1
BMP280 = smd 0.35 x 0.5: 1 0.975,-0.8; 2 0.325,-0.8; 3 -0.325,-0.8; 4 -0.975,-0.8; 5 -0.975,0.8; 6 -0.325,0.8; 7 0.325,0.8; 8 0.975,0.8
DFN6_TAOS = smd 1.3 x 0.4: 1 -0.8,0.65; 2 -0.8,0; 3 -0.8,-0.65; 4 0.8,-0.65; 5 0.8,0; 6 0.8,0.65
RFM69HCW-XXXS2 = smd 3 x 1.2: 1 -7.5,7; 2 -7.5,5; 3 -7.5,3; 4 -7.5,1; 5 -7.5,-1; 6 -7.5,-3; 7 -7.5,-5; 8 -7.5,-7; 9 7.5,-7; 10 7.5,-5; 11 7.5,-3; 12 7.5,-1; 13 7.5,1; 14 7.5,3; 15 7.5,5; 16 7.5,7
MH-Z19 = drill 1 pad 2: AOT 1.515,9.75; GND 1.515,7.21; HD 31.055,14.83; PWM 1.515,12.29; RX 31.055,7.21; SR 31.055,12.29; TX 31.055,9.75; VIN 1.515,4.67; VOUT 31.055,4.67
LGA = smd 0.6 x 0.35: 1 0.3,3.2; 2 0.3,2.6; 3 0.3,2; 4 0.3,1.4; 5 0.3,0.8; 6 2.4,0.8; 7 2.4,1.4; 8 2.4,2; 9 2.4,2.6; 10 2.4,3.2 | smd 1.1 x 2.3: 11 1.35,2
IAQ-CORE-C = smd 2.54 x 1.4: GND 0,4.9; P$3 0,9.98; P$5 15.2,7.44; SCL 0,7.44; SDA 15.2,4.9; VCC 15.2,9.98
QFN-16_3X3 = smd 0.9 x 0.3: 1 -1.45,0.75; 2 -1.45,0.25; 3 -1.45,-0.25; 4 -1.45,-0.75; 9 1.45,-0.75; 10 1.45,-0.25; 11 1.45,0.25; 12 1.45,0.75 | smd 0.3 x 0.9: 5 -0.75,-1.45; 6 -0.25,-1.45; 7 0.25,-1.45; 8 0.75,-1.45; 13 0.75,1.45; 14 0.25,1.45; 15 -0.25,1.45; 16 -0.75,1.45 | smd 1.5 x 1.5: 17 0,0
FIDUCIAL_1MM = smd 1 x 1: 1 0,0
CONN_4POS_VERT_2.54_SMD = smd 1.27 x 2.96: P$1 0.635,1.8; P$2 3.175,-1.8; P$3 5.715,1.8; P$4 8.255,-1.8
CONN_HDR_1.27MM_SMD_4POS = smd 0.65 x 3: P$1 0.635,1.5; P$2 1.905,-1.5; P$3 3.175,1.5; P$4 4.445,-1.5
RESONATOR-SMD = smd 0.7 x 1.7: 1 -1.2,0; 2 0,0; 3 1.2,0

### Placement (x,y rotation side)
C1  30.53,39.6 270 top
C2  41.12,2.69 90 top
C3  22.86,17.98 270 top
C4  37.44,37.34 270 top
C5  18.95,35.05 270 top
C6  26.76,43.7 90 top
C7  21.67,2.16 90 top
C8  5.59,43 0 top
C9  46.89,35.86 90 top
C11  35.92,37.74 90 top
C12  34.71,33.03 0 top
C15  28.89,33.01 90 top
C16  45.67,38.25 180 top
C17  8.03,40.36 180 top
C18  24.99,21.67 180 top
C19  37.41,48.69 90 top
C20  38.96,46.05 180 top
C22  47.14,28.7 90 top
C23  49.12,35.86 90 top
C24  44.7,33.07 0 top
D1  28.4,42.35 90 top
D3  41.3,26.62 0 top
D4  43.74,26.62 0 top
H1  2.54,48.26 0 top
H2  2.54,2.54 0 top
H3  48.26,25.4 0 top
J1  2.03,25.4 90 top
J2  2.03,30.48 90 top
J3  25.4,49.28 180 top
JP1  47.62,19.3 0 top
MK1  47.96,32.05 90 top
R4  23.09,29.03 270 top
R5  32.66,33.04 180 top
R6  32.31,35.81 90 top
R7  25.4,6.91 270 top
R9  42.24,2.69 270 top
R10  17.37,36.32 0 top
R11  24.11,43.7 90 top
R12  34.21,2.16 270 top
R13  31.19,35.81 90 top
R15  25.41,43.7 270 top
R16  4.9,44.86 270 top
R17  13.4,46.61 0 top
R18  17.43,46.61 180 top
R19  11.42,44.02 270 top
R20  14.32,38.63 180 top
R21  6.1,44.86 90 top
R22  45.77,35.86 270 top
R23  48.01,35.86 90 top
R24  42.67,33.07 0 top
R25  43.94,25.35 180 top
R26  45.72,28.7 90 top
R27  48.51,28.7 90 top
R28  38.91,32.11 0 top
R29  38.91,33.38 180 top
R30  39.42,28.14 90 top
R31  41.1,25.35 180 top
R32  36.83,32.66 270 top
RX  16.91,48.26 90 top
S1  2.21,40.94 90 top
TC1  34.02,27.84 180 top
TX  12.88,48.26 90 top
U1  24.1,24.1 0 top
U2  14.79,43.05 90 top
U4  47.73,48.12 0 top
U5  25.4,34.8 0 top
U7  42.07,49.21 270 bottom
U8  33.48,39.37 0 top
U9  39.23,48.22 90 top
U10  25.4,2.69 180 top
U11  35.81,14.21 90 top
U12  2.44,37.83 270 top
U13  40.16,1.06 90 top
U14  5.08,7.49 0 top
U15  23.37,23.27 0 top
U16  23.32,4.78 270 top
U17  42.49,30.02 0 top
U$1  5.94,48.54 0 top
U$2  6.68,2.69 0 top
U$3  33.45,47.4 0 top
U$4  6.48,36.32 0 top
U$5  6.48,6.78 0 top
U$6  45.29,43.1 0 top
U$7  37.29,11.46 0 top
X1  20.86,32.16 270 top

### Tracks (layer width: path | path; a pad name or v marks a point on that pad's centre or on a via)
_OUT  (via drill 0.25)
  Top 0.178: R27.1 v49.78,28.19 | v39.73,26.47 39.22,26.47 38.71,26.98 38.71,29.26 36.83,31.14 R32.2 | U17.7 42.74,28.12 v43.43,27.43
  Bottom 0.178: v49.78,28.19 46.53,28.19 45.57,27.23 | v39.73,26.47 40.79,25.4 40.79,24.54 41.45,23.88 44.04,23.88 45.57,25.4 45.57,27.23 | v43.43,27.43 43.94,27.43 44.15,27.23 45.57,27.23
A0  (via drill 0.25)
  Top 0.178: U5.23 28.33,36.05 28.6,35.77 v28.6,35.51 | R32.1 36.83,33.88 v36.68,34.04
  Bottom 0.178: v28.6,35.51 28.6,34.14 29.72,33.02 35.66,33.02 v36.68,34.04
A1  (via drill 0.25)
  Top 0.178: U5.24 28.5,36.55 v28.57,36.63 | v21.54,41.1 20.68,40.23 19.96,40.23 19.36,39.62 19.36,36.88 20.21,36.03 v21.57,36.03
  Bottom 0.178: v21.54,41.1 21.54,43.23 22.25,43.94 30.07,43.94 30.48,44.35 U7.9 | v21.57,36.03 22.79,36.03 23.85,37.08 28.09,37.08 28.55,36.63 v28.57,36.63
AMP
  Top 0.178: U17.15 42.24,32.13 R24.2 C24.1
ANT
  Top 1.016: JP1.1 arc90 45.22,21.71 U11.9
D2  (via drill 0.25)
  Top 0.178: 28.79,24.04 v28.75,24.08 31.8,24.08 32.81,23.07 U11.14 | U5.32 22.72,37.1 22.4,37.41 21.31,37.41 20.98,37.08 v20.98,36.91
  Bottom 0.178: v28.75,24.08 27.94,24.08 26.31,25.7 26.31,28.65 23.65,31.32 22.28,31.32 19.76,33.83 19.76,35.69 v20.98,36.91
D3  (via drill 0.25)
  Top 0.178: U5.1 22.28,36.55 v22.1,36.73 | R21.1 C8.2 6.1,42.44 5.82,42.16 4.42,42.16 3.83,41.58 3.83,34.21 v5.92,32.13
  Bottom 0.178: v5.92,32.13 15.19,32.13 16.95,33.89 16.95,37.47 17.27,37.8 21.59,37.8 22.1,37.29 v22.1,36.73
D4  (via drill 0.25)
  Top 0.178: v20.42,41.15 20.22,41.15 18.9,39.83 18.9,36.83 20.24,35.48 21.79,35.48 22.36,36.05 U5.2
  Bottom 0.178: v20.42,41.15 20.42,43.74 21.08,44.4 29.59,44.4 30.61,45.41 32.97,45.41 33.39,44.99 U7.7
D5  (via drill 0.25)
  Top 0.178: U5.9 23.65,31.22 22.15,29.72 v22.15,27.13 | v38.66,4.42 38.76,4.32 U13.7
  Bottom 0.178: v38.66,4.42 28.78,4.42 28.22,4.98 28.22,6.35 26.72,7.85 25.43,7.85 24.61,8.66 24.61,12.9 28.47,16.76 28.47,22.3 23.65,27.13 v22.15,27.13
D6
  Top 0.178: U5.10 24.15,30.75 23.09,29.69 R4.1
D7  (via drill 0.25)
  Top 0.178: U5.11 24.65,30.29 v24.18,29.82 | U$5.P$2 U12.RX
  Bottom 0.178: v24.18,29.82 15.39,29.82 9.65,24.08 U12.RX
D8  (via drill 0.25)
  Top 0.178: U5.12 25.15,29.42 v24.84,29.11 | U$5.P$3 U12.TX
  Bottom 0.178: v24.84,29.11 16.36,29.11 12.19,24.94 U12.TX
D9  (via drill 0.25)
  Top 0.178: U5.13 25.65,28.5 v25.5,28.35 | v23.98,41.1 23.72,41.1 22.3,39.67 20.57,39.67 19.94,39.04 v19.94,37.21 | v17.88,28.35 R10.2 v17.88,37.21
  Bottom 0.178: v25.5,28.35 v17.88,28.35 | U7.10 28.24,43.07 26.21,41.05 24.03,41.05 v23.98,41.1 | v17.88,37.21 v19.94,37.21
DTR  (via drill 0.25)
  Top 0.178: C12.2 35.21,34.66 v35.26,34.7 | U2.DTR# 12.06,43.02 11.12,42.09 v11.12,41.15
  Bottom 0.178: v35.26,34.7 30.63,39.32 24.21,39.32 23.7,39.83 18.14,39.83 17.09,40.87 11.4,40.87 v11.12,41.15
FTDI_VCC  (via drill 0.25)
  Top 0.254: U2.VCCIO 12.82,41.58 11.63,40.39 10.46,40.39 9.55,41.3 9.55,44.68 10.34,45.47 v12.33,45.47 | v12.33,45.47 v12.34,45.47 | R17.1 12.9,46.03 v12.33,45.47 | U2.RESET# 16.32,44.52 | 16.32,44.52 U2.3V3OUT | 16.32,44.52 16.34,44.52 v16.97,45.15 16.92,45.2 R18.2
  Bottom 0.254: v12.34,45.47 16.66,45.47 v16.97,45.15
GND  (via drill 0.25)
  Top 0.178: U4.GND 49.87,48.12 50.24,47.75 50.24,44.63 49.73,44.12 U$6.P$4 | U9.7 37.77,48.54 C19.1 | U5.5 23.88,34.55 v24.13,34.8 | U5.21 26.92,35.05 v26.67,34.8 | U2.GND_PIN21 v14.35,42.55 | U5.3 23.61,35.55 v24.13,36.07
  other vias: 43.21,39.78 29.77,29.26 22.71,3.71 20.88,3.51 27.3,8.41 49.48,18.85 45.62,18.8 43.38,16.87 43.38,13.56 43.38,10.11 43.48,0.97 9.68,26.97 32.26,14.63 35.56,13 43.84,18.54 43.38,15.19 43.38,11.84 49.76,39.01 22.96,1.63 21.44,10.87 38.76,24.08 38.46,16.31 40.44,35.61 35.1,31.9 40.28,28.55 46.66,22.94 45.21,31.34 39.47,40.39 32.84,19.25 26.87,20.8 23.85,11.53 28.88,0.99 17.12,18.29 10.97,18.34 6.86,24.08 1.22,20.27 5.49,46.79 19.18,45.29 9.96,38.66 12.09,29.67 1.22,5.33 15.29,10.26 26.72,11.68 21.34,25.96 31.39,47.29 12.37,33.2 19.25,27.28 24.13,33.53 26.67,33.53 25.4,33.53 25.4,36.07 26.67,36.07 14.35,43.56 15.24,43.56 15.24,42.55 25.4,34.8
  pour Top (rank 6): -0.25,51.05 44.2,51.05 44.2,40.13 51.05,40.13 51.05,-0.25 -0.25,-0.25
  pour Bottom: -0.51,51.31 44.45,51.31 44.45,40.13 51.31,40.13 51.31,-0.51 -0.51,-0.51
MISO  (via drill 0.25)
  Top 0.178: v34.09,31.19 35.29,29.98 TC1.1 35.29,28.94 36.02,29.67 37.18,29.67 37.85,29 v37.85,27.03 | U5.16 27.15,31.52 28.02,30.66 v28.4,30.66 | U11.2 30.81,9.67 v30.38,10.11
  Bottom 0.178: v37.85,27.03 37.85,17.58 v30.38,10.11 | v34.09,31.19 31.5,31.19 31.11,31.57 29.9,31.57 28.98,30.66 v28.4,30.66
MOSI  (via drill 0.25)
  Top 0.178: TC1.4 34.02,26.5 v32.97,25.45 30.84,25.45 30.12,26.16 30.12,27.53 26.65,31.01 U5.15 | v28.91,11.58 28.96,11.53 31.45,11.53 32.81,10.16 U11.3
  Bottom 0.178: v28.91,11.58 28.91,13.66 33.78,18.54 33.78,24.64 v32.97,25.45
N$1
  Top 0.178: 24.51,25.99 U1.DIN 23.09,27.35 R4.2
N$2
  Top 0.178: R20.2 13.82,38.64 U2.RXD
N$3
  Top 0.178: U2.TXD 11.43,43.52 R19.2
N$4
  Top 0.178: X1.3 22.07,30.96 22.55,31.45 22.55,32.77 22.84,33.05 U5.8
N$5
  Top 0.178: U5.7 21.25,33.55 X1.1
N$6
  Top 0.178: U13.2 37.56,0.73 37.39,0.56 35.43,0.56 34.34,1.65 R12.2
N$7
  Top 0.178: R21.2 R16.1 3.48,45.36 S1.2
N$8
  Top 0.178: C9.2 R22.1
N$9
  Top 0.178: C9.1 R23.1
  Top 0.406: R23.1 48.01,33.31 MK1.OUT
N$12
  Top 0.178: R22.2 43.69,35.36 42.16,33.83 R24.1 41.74,32.65 U17.16
N$13  (via drill 0.25)
  Top 0.178: R9.2 v43.38,2.18 | U13.1 35.75,1.36 v35.41,1.7
  Bottom 0.178: v35.41,1.7 42.9,1.7 v43.38,2.18
N$14
  Top 0.178: 42,26.01 D3.C | 42,26.01 42,25.74 R31.1 | 42,26.01 43.54,26.01 44.15,26.62 D4.C R25.1
N$15  (via drill 0.25)
  Top 0.178: v49.84,29.21 R27.2 | U17.8 43.72,28.57 v44.2,28.09
  Bottom 0.178: v49.84,29.21 45.47,29.21 44.35,28.09 v44.2,28.09
N$17
  Top 0.178: U2.CBUS1 14.32,45.9 14.58,46.15 14.58,46.98 RX.C
N$18  (via drill 0.25)
  Top 0.178: TX.C 10.87,48.26 v10.11,47.5 | v18.85,40.79 18.85,41.78 18.11,42.52 U2.CBUS2
  Bottom 0.178: 18.75,40.79 v18.85,40.79 18.01,40.79 17.35,41.45 11.94,41.45 11.48,41.91 10.36,41.91 9.55,42.72 9.55,46.94 v10.11,47.5
N$19  (via drill 0.25)
  Top 0.178: C24.2 v45.21,33.98 | v39.73,29.52 39.73,28.96 R30.2
  Bottom 0.178: v45.21,33.98 44.2,33.98 v39.73,29.52
N$20  (via drill 0.25)
  Top 0.178: R25.2 v42.62,24.54 | v45.92,30.33 47.04,29.21 C22.2 45.77,29.21 | 45.77,29.21 R26.2 | U17.9 45.71,29.27 45.77,29.21
  Bottom 0.178: v42.62,24.54 42.06,24.54 41.6,24.99 41.6,29.11 42.47,29.97 45.57,29.97 v45.92,30.33
N$21
  Top 0.178: U17.6 42.24,27.41 D4.A
N$22
  Top 0.178: U17.5 41.32,28.57 40.72,27.96 | 40.72,27.96 40.39,27.64 R30.1 | 40.72,27.96 40.6,27.85 D3.A R31.2
N$25
  Top 0.178: R15.2 25.4,42.83 25.04,42.47 22.35,42.47 21.3,43.52 U2.USBDM
N$26  (via drill 0.25)
  Top 0.178: R11.1 22.87,43.19 v22.86,43.18 | U2.USBDP 21.24,43.02 v22.86,41.4
  Bottom 0.178: v22.86,41.4 v22.86,43.18
N$27
  Top 0.178: RX.A 17.94,47.52 R18.1
N$29
  Top 0.178: TX.A 13.91,47.52 R17.2
N$32
  Top 0.178: J3.D- 26.05,44.85 R15.1
N$33
  Top 0.178: J3.D+ 25.4,45.5 R11.2
PWR  (via drill 0.25)
  Top 0.406: U12.VIN U$4.P$1 7.52,38.53 C17.2 7.52,42.64 v7.62,42.74
  Top 0.813: D1.C C1.1 33.45,40.5 U8.3 v36.11,40.48 37.2,41.57 U7.2 U7.1 | TC1.2 35.29,26.38 v36.02,25.65 | v8.94,49.02 7.62,47.7 v7.62,42.74
  Bottom 0.813: U7.1 37.2,45.81 34,49.01 8.95,49.01 v8.94,49.02 | v36.02,25.65 35.31,26.36 35.31,27.28 35.28,27.31 35.28,30.2 38.41,33.33 38.41,38.19 v36.11,40.48 | v7.62,42.74 2.03,37.15 J2.2
RESET  (via drill 0.25)
  Top 0.178: U5.29 25.15,38.21 v25.6,38.66 | v34.24,34.7 34.2,34.66 C12.1 R5.1 33.16,29.71 32.84,29.38 | 32.84,29.38 32.77,29.31 | TC1.5 32.75,29.3 32.84,29.38
  Bottom 0.178: v25.6,38.66 30.38,38.66 34.24,34.8 v34.24,34.7
RX  (via drill 0.25)
  Top 0.178: v24.64,40.34 24.65,40.32 U5.30 | R19.1 11.02,44.53 10.46,43.97 v10.46,42.98
  Bottom 0.178: v24.64,40.34 20.27,40.34 20.19,40.34 19.76,40.77 19.76,43.23 18.47,44.53 12.01,44.53 v10.46,42.98
SCK  (via drill 0.25)
  Top 0.178: U5.17 27.7,32.04 28.45,31.29 29.84,31.29 v30.71,30.43 | TC1.3 34.02,29.45 v34.04,29.46 | U11.4 34.81,17.03 v35.05,17.27
  Bottom 0.178: v35.05,17.27 36.47,18.69 36.47,23.32 34.04,25.76 v34.04,29.46 33.07,30.43 v30.71,30.43
SCL  (via drill 0.25)
  Top 0.178: U5.28 25.65,37.64 26.36,38.35 | v31.19,34.49 R13.1 30.68,35.31 30.38,35.61 30.38,36.93 28.96,38.35 26.36,38.35 | U4.SCK 46.23,46.53 v46.89,45.87 47.19,45.57 U$6.P$2 | U9.4 40.59,47.24 41.4,46.43 v41.4,45.01 v39.67,43.28 | 26.36,38.35 26.92,38.91 26.92,40.23 v26.72,40.44 | U10.1 27.59,2.04 | 27.59,2.04 28.04,2.49 28.04,3.71 26.77,4.98 24.38,4.98 v23.06,6.3 | 27.59,2.04 29.68,2.04 31.17,3.53 36.89,3.53 U13.10 | v1.02,12.7 3.25,14.93 U14.SCL 13.36,14.93 v17.58,10.72
  Bottom 0.178: v41.4,45.01 41.4,40.23 42.98,38.66 46.28,38.66 46.89,39.27 v46.89,45.87 | 26.87,40.44 v26.72,40.44 27.99,41.71 38.1,41.71 v39.67,43.28 | v23.06,6.3 23.15,6.26 23.06,6.35 23.06,7.87 20.22,10.72 v17.58,10.72 | v31.19,34.49 31.19,33.88 30.94,33.63 29.97,33.63 29.31,34.29 29.31,36.73 28.5,37.54 24.64,37.54 23.37,38.81 17.78,38.81 17.02,39.57 7.37,39.57 4.83,37.03 4.83,25.4 | v1.02,12.7 1.02,16.26 4.83,20.07 4.83,25.4 | J1.1 4.82,25.4 4.83,25.4
SDA  (via drill 0.25)
  Top 0.178: U5.27 26.15,37.58 26.52,37.95 28.7,37.95 29.87,36.78 v29.87,34.54 30.58,33.83 31.47,33.83 32.31,34.67 R6.1 38.91,35.31 v40.59,36.98 | U9.3 41.13,47.89 v41.15,47.9 | U10.6 24.6,1.44 23.93,0.76 | 23.93,0.76 21.23,0.76 20.23,1.77 U14.SDA 17.07,12.39 13.69,15.77 10.87,15.77 8.13,18.52 8.13,25.25 5.44,27.94 J1.2 | v29.36,3.4 30.33,4.37 37.08,4.37 37.56,3.89 U13.9 | v25.4,1.02 25.15,0.76 23.93,0.76 | U4.DATA 49.23,46.53 49.48,46.28 v49.48,45.64 49.48,45.09 49,44.6 U$6.P$3
  Bottom 0.178: v41.15,47.9 41.15,46.28 40.59,45.72 v40.59,36.98 41.6,38 46.74,38 48.56,39.83 48.56,45.09 49.12,45.64 v49.48,45.64 | v25.4,1.02 25.4,2.08 26.72,3.4 v29.36,3.4 | v29.87,34.54 29.87,36.78 28.57,38.08 24.84,38.08 23.65,39.27 17.93,39.27 16.87,40.34 6.86,40.34 3.79,37.26 3.79,28.63 3.1,27.94 J1.2
SS  (via drill 0.25)
  Top 0.178: U5.14 26.15,30.8 29.62,27.33 29.62,25.3 v29.92,24.99 | R7.1 v25.4,8.89 | 36.38,8.73 36.45,8.66 | 36.38,8.73 v36.02,9.09 | U11.5 36.81,8.3 36.38,8.73
  Bottom 0.178: v29.92,24.99 29.92,17.02 25.4,12.5 v25.4,8.89 25.6,9.09 v36.02,9.09
TX  (via drill 0.25)
  Top 0.178: v22.48,38.25 23.62,38.25 24.15,37.72 U5.31 | v16.66,38.63 R20.1
  Bottom 0.178: v16.66,38.63 17.04,38.25 v22.48,38.25
VBUS  (via drill 0.25)
  Top 0.254: U2.VCC v15.32,46.25
  Top 0.356: 26.7,44.21 C6.2 | D1.A
  Bottom 0.254: v26.98,45.01 26.98,45.82 24.89,47.9 16.26,47.9 15.32,46.97 v15.32,46.25
  pour Top (no thermals): 26.57,47.29 27.53,47.29 29.11,45.72 29.11,43.54 27.74,43.54 27.33,43.94 26.57,43.94
VCC  (via drill 0.25)
  Top 0.178: 17.17,31.61 17.17,35.31 16.87,35.61 R10.1 | 17.17,31.61 17.17,27.08 18.14,26.11 20.39,26.11 20.47,26.19 | 35.36,2.56 v35.41,2.56 34.92,2.56 34.82,2.67 R12.1 | R16.2 4.39,44.35 3.81,43.76 v3.81,43.2 | 17.17,31.61 17.16,31.6 8.31,31.6 4.62,35.28 v4.62,41.27 | R29.2 38.41,34.09 38.96,34.65 v41.71,34.65
  Top 0.305: U5.18 28.86,33.55 C15.2 29.43,33.52 29.91,33.04 R5.2 | U5.4 22.25,35.05 21.74,34.54 22.24,34.05 U5.6 | U17.2 v38.76,30.27 v38.76,30.28
  Top 0.356: U9.8 37.42,49.19 C19.2 36.55,49.2 36.07,48.72 36.07,47.95 36.78,47.24 U9.5 | U9.6 U9.5 | U9.5 38.46,47.22 C20.2 38.46,38.39 38.31,38.24
  Top 0.406: U8.2 34.43,37.27 33.48,36.32 R6.2 R13.2 31.19,37.08 v30.93,37.33 | U1.VCC C18.2 | C18.2 24.49,17.49 | 24.49,17.49 24.49,16.87 22.89,15.27 22.89,9.83 | 34.45,19.16 32.78,17.49 24.49,17.49 | 22.89,9.83 21.69,8.64 21.69,2.69 | R7.2 24.28,6.41 22.89,7.8 22.89,9.83 | C2.2 | C2.2 R9.1 42.77,3.2 v43.33,3.76 | 34.45,19.16 37.99,19.16 39.83,17.32 v39.83,16.56 39.83,11.58 41.55,9.86 v42.47,9.86 | R5.2 32.15,33.32 v32.92,34.09 | 38.87,25.76 v38.76,25.65 | C5.2 | C5.2 21.74,34.54 | C5.2 18.95,30.12 20.47,28.6 20.47,26.19 20.47,23.32 22.15,21.64 24.46,21.64 C18.2 | 21.69,2.69 C7.2 | U10.5 21.69,2.69 | U14.VCC C3.2 24.48,17.48 24.49,17.49 | U11.13 34.81,19.52 34.45,19.16 | U13.6 39.89,3.46 40.16,3.2 C2.2 | v49.12,37.39 C23.2 R23.2
  Top 0.508: U8.2 34.45,38.25 C11.2 37.42,38.25 C4.1 38.31,38.24 41.82,38.24 | U4.VDD 45.66,48.12 45.17,47.64 | 45.17,47.64 45.16,47.62 C16.2 45.14,38.24 41.82,38.24 | v41.71,34.65 41.71,38.12 41.82,38.24 | U$6.P$1 45.82,44.6 45.17,45.25 45.17,47.64
  Bottom 0.178: v35.41,2.56 42.14,2.56 v43.33,3.76 | v3.81,43.2 3.81,41.94 4.47,41.27 v4.62,41.27
  Bottom 0.406: v30.93,37.33 30.93,36.07 v32.92,34.09 | v42.47,9.86 42.47,4.62 v43.33,3.76 | v39.83,16.56 39.83,24.59 v38.76,25.65 v38.76,30.28 38.76,30.48 41.71,33.43 v41.71,34.65 44.45,37.39 v49.12,37.39
VCC/2
  Top 0.178: 39.42,32.72 R29.1 | 39.42,32.72 R28.2 | U17.1 41.04,32.36 40.64,32.77 39.47,32.77 39.42,32.72

### Text on the board
_tsilk: PWR | GND | SDA | SCL
_bsilk: Designed by Akram Ali | crtlabs.org | v0.5.7 | October 2017 | Touchstone